# EAGLE board rl_energy_board (EAGLE 9.6.2)
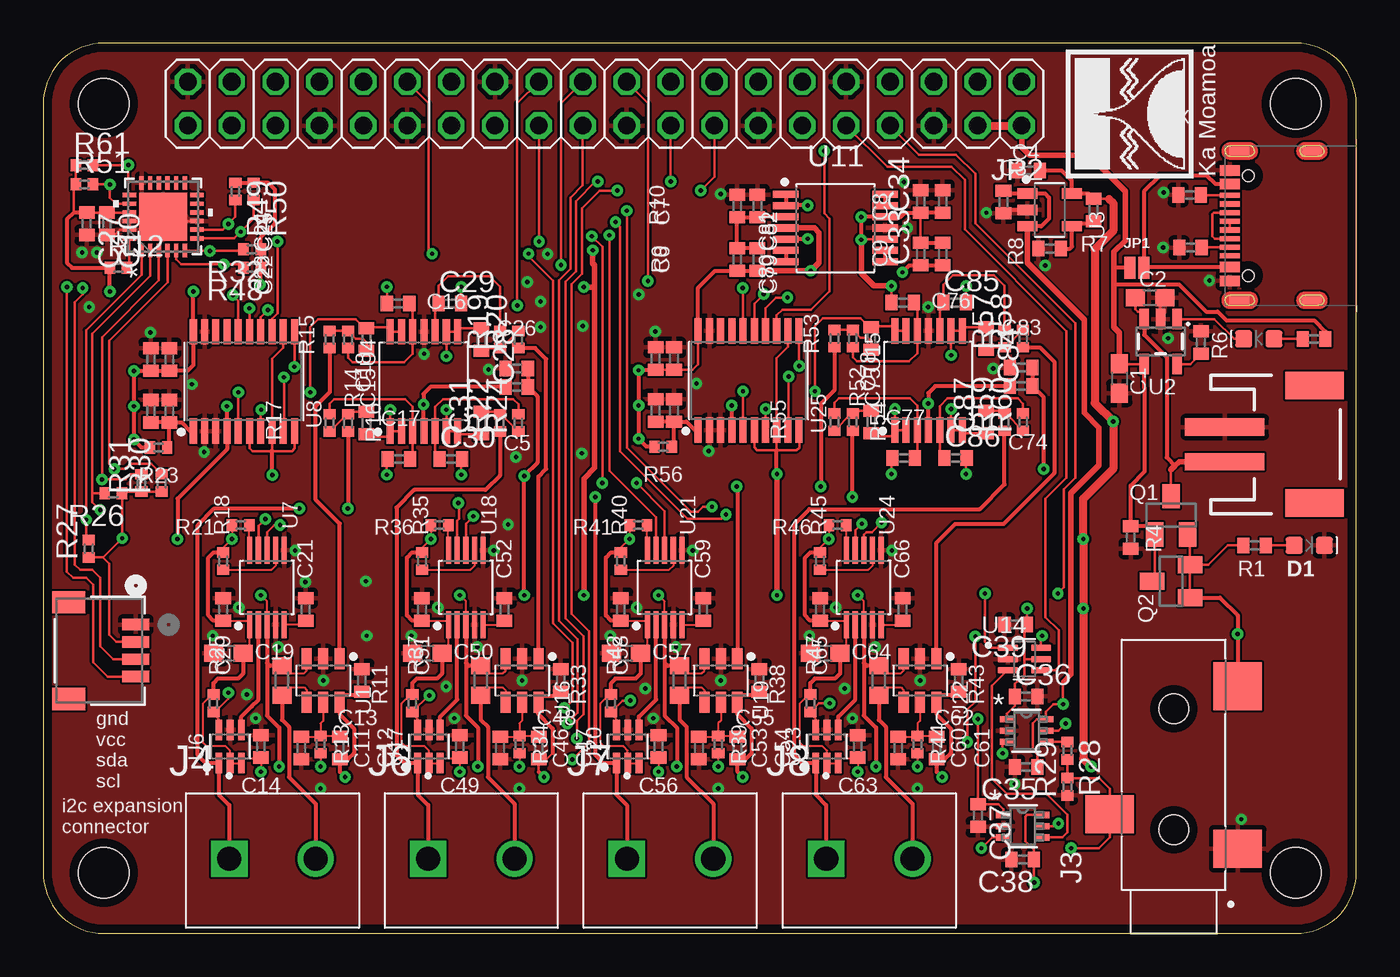
[diagram p4: board, top side]
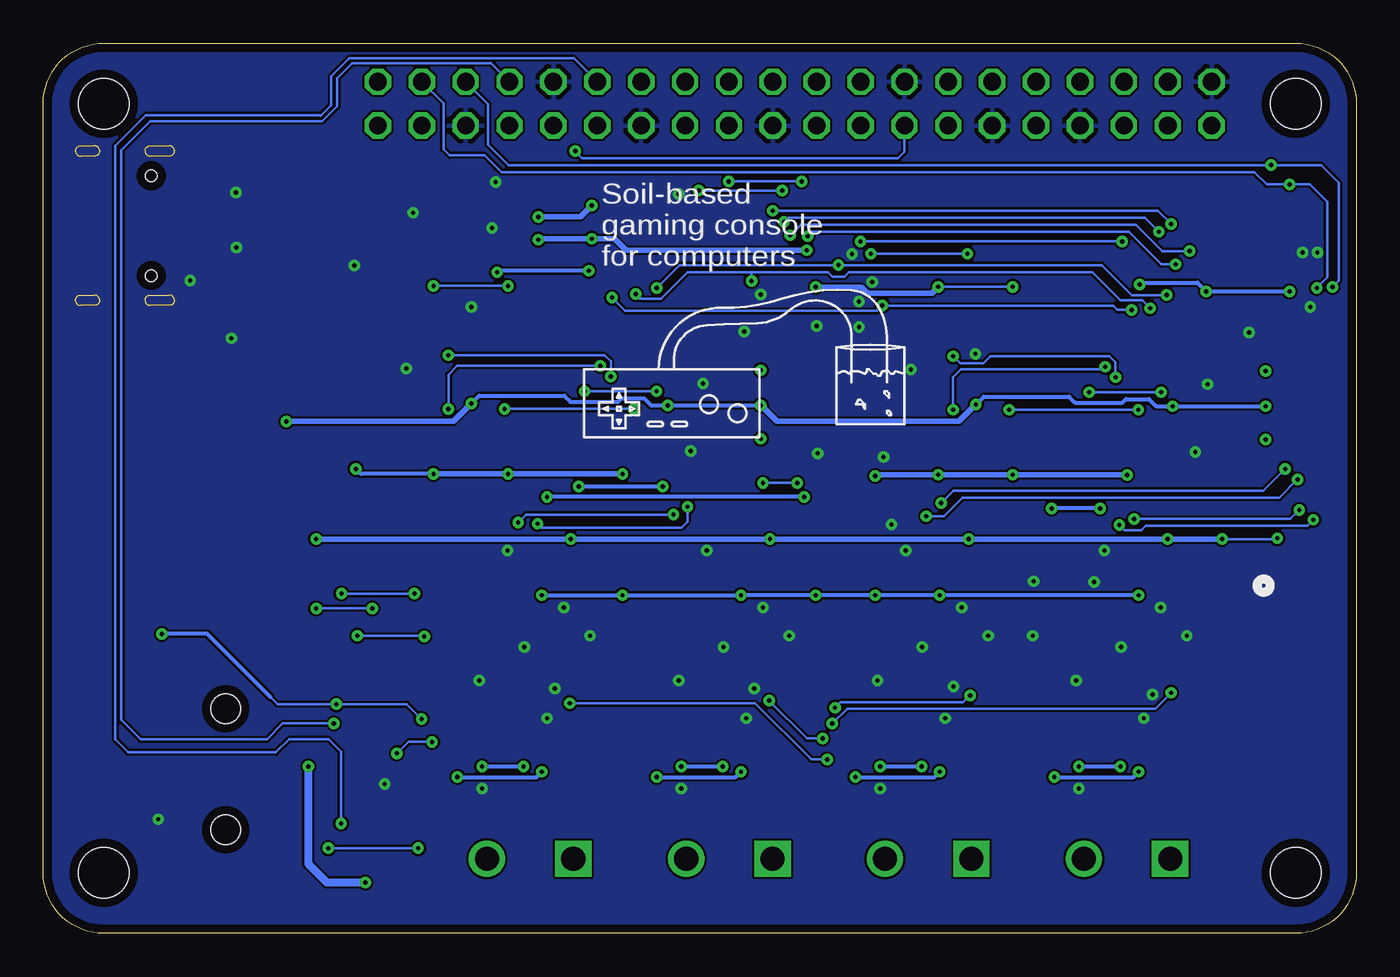
[diagram p5: board, bottom side, seen from below]

Size 76 x 51.5 mm. Coordinates in mm from the lower left corner, seen from the top.
Outline: 0,3.5 arc90 3.5,0 72.5,0 arc90 76,3.5 76,48 arc90 72.5,51.5 3.5,51.5 arc90 0,48 0,3.5
Copper layers (1*16): Top 0.035mm / dielectric 1.5mm / Bottom 0.035mm
Design rules "default *": minimum track width 5mil, minimum drill 0.25mm, track to track 5mil, track to pad 5mil, pad to pad 5mil, via to via 5mil, smd to smd 5mil, copper to edge 20mil, drill to drill 6mil, minimum pad ring 10mil, minimum via ring 8mil, stop-mask expansion 4mil, vias tented up to drill 20mil, thermal gap 10mil
Holes 2.9 mm at 3.5,48 3.5,3.5 72.5,48 72.5,3.5

## Footprints (pad centres in the part's own frame; a part is rotated, then mirrored left to right if it is on the bottom)
C0603 = smd 1.1 x 1: 1 -0.85,0; 2 0.85,0
C0402 = smd 0.7 x 0.9: 1 -0.65,0; 2 0.65,0
LED-0603 = smd 1 x 1: A -0.877,0; C 0.877,0
JST-2-SMD = smd 1 x 4.6: 1 -1,-3.7; 2 1,-3.7 | smd 1.6 x 3.4: NC1 -3.4,1.5; NC2 3.4,1.5
USB4105 = smd 0.6 x 1.15: A1B12 -3.2,4.755; A4B9 -2.4,4.755; B1A12 3.2,4.755; B4A9 2.4,4.755; SHELL_GND@0 -4.3,4.2; SHELL_GND@1 4.3,4.2; SHELL_GND@2 -4.3,0; SHELL_GND@3 4.3,0 | smd 0.3 x 1.15: A5 -1.25,4.755; A6 -0.25,4.755; A7 0.25,4.755; A8 1.25,4.755; B5 1.75,4.755; B6 0.75,4.755; B7 -0.75,4.755; B8 -1.75,4.755 | hole 0.65: -2.89,3.68; 2.89,3.68
CUI_SJ-3523-SMT-TR = smd 2.2 x 2.8: 1 -1.1,-3.7; 3 0.9,3.7 | smd 2.8 x 2.8: 2 8.3,-3.7 | hole 1.7: 0,0; 7,0
CUI_TB003-500-P02BE = drill 1.4 square: 1 0,0 | drill 1.4: 2 5,0
CONN_SM04B-SRSS-TB_JST = smd 0.66 x 1.549: 1 1.5,-2.099; 2 0.5,-2.099; 3 -0.5,-2.099; 4 -1.5,-2.099 | smd 1.295 x 1.905: 5 -2.8,1.776; 6 2.8,1.776
SMT-JUMPER_2_NO_NO-SILK = smd 0.635 x 1.27: 1 -0.406,0; 2 0.406,0
2X20 = drill 1.016 octagon: 1 -24.13,-1.27; 2 -24.13,1.27; 3 -21.59,-1.27; 4 -21.59,1.27; 5 -19.05,-1.27; 6 -19.05,1.27; 7 -16.51,-1.27; 8 -16.51,1.27; 9 -13.97,-1.27; 10 -13.97,1.27; 11 -11.43,-1.27; 12 -11.43,1.27; 13 -8.89,-1.27; 14 -8.89,1.27; 15 -6.35,-1.27; 16 -6.35,1.27; 17 -3.81,-1.27; 18 -3.81,1.27; 19 -1.27,-1.27; 20 -1.27,1.27; 21 1.27,-1.27; 22 1.27,1.27; 23 3.81,-1.27; 24 3.81,1.27; 25 6.35,-1.27; 26 6.35,1.27; 27 8.89,-1.27; 28 8.89,1.27; 29 11.43,-1.27; 30 11.43,1.27; 31 13.97,-1.27; 32 13.97,1.27; 33 16.51,-1.27; 34 16.51,1.27; 35 19.05,-1.27; 36 19.05,1.27; 37 21.59,-1.27; 38 21.59,1.27; 39 24.13,-1.27; 40 24.13,1.27
SOT23 = smd 1 x 1.4: 1 -0.95,-1.1; 2 0.95,-1.1; 3 0,1.1
R0402 = smd 0.7 x 0.9: 1 -0.65,0; 2 0.65,0
R0603 = smd 1 x 1.1: 1 -0.85,0; 2 0.85,0
R0402' = smd 0.6 x 0.7: 1 -0.5,0; 2 0.5,0
SOT95P280X145-6N = smd 1.209 x 0.584: 1 -1.253,0.95; 2 -1.253,0; 3 -1.253,-0.95; 4 1.253,-0.95; 5 1.253,0; 6 1.253,0.95
SOT23-5 = smd 0.55 x 1.2: 1 -0.95,-1.3; 2 0,-1.3; 3 0.95,-1.3; 4 0.95,1.3; 5 -0.95,1.3
SOT95P285X130-5N = smd 1.146 x 0.597: 1 -1.287,0.95; 2 -1.287,0; 3 -1.287,-0.95; 4 1.287,-0.95; 5 1.287,0.95
SOP65P640X120-14N = smd 1.469 x 0.407: 1 -2.871,1.95; 2 -2.871,1.3; 3 -2.871,0.65; 4 -2.871,0; 5 -2.871,-0.65; 6 -2.871,-1.3; 7 -2.871,-1.95; 8 2.871,-1.95; 9 2.871,-1.3; 10 2.871,-0.65; 11 2.871,0; 12 2.871,0.65; 13 2.871,1.3; 14 2.871,1.95
QFN_GERQ1_TEX = smd 0.787 x 0.254: 1 -1.956,1.25; 2 -1.956,0.75; 3 -1.956,0.25; 4 -1.956,-0.25; 5 -1.956,-0.75; 6 -1.956,-1.25; 13 1.956,-1.25; 14 1.956,-0.75; 15 1.956,-0.25; 16 1.956,0.25; 17 1.956,0.75; 18 1.956,1.25 | smd 0.254 x 0.787: 7 -1.25,-1.956; 8 -0.75,-1.956; 9 -0.25,-1.956; 10 0.25,-1.956; 11 0.75,-1.956; 12 1.25,-1.956; 19 1.25,1.956; 20 0.75,1.956; 21 0.25,1.956; 22 -0.25,1.956; 23 -0.75,1.956; 24 -1.25,1.956 | smd 2.794 x 2.794: 25 0,0
SOT65P210X110-6N = smd 1.186 x 0.397: 1 -0.962,0.65; 2 -0.962,0; 3 -0.962,-0.65; 4 0.962,-0.65; 5 0.962,0; 6 0.962,0.65
SOP50P490X95-10N = smd 1.55 x 0.297: 1 -2.156,1; 2 -2.156,0.5; 3 -2.156,0; 4 -2.156,-0.5; 5 -2.156,-1; 6 2.156,-1; 7 2.156,-0.5; 8 2.156,0; 9 2.156,0.5; 10 2.156,1
SOP65P640X120-20N = smd 1.469 x 0.407: 1 -2.871,2.925; 2 -2.871,2.275; 3 -2.871,1.625; 4 -2.871,0.975; 5 -2.871,0.325; 6 -2.871,-0.325; 7 -2.871,-0.975; 8 -2.871,-1.625; 9 -2.871,-2.275; 10 -2.871,-2.925; 11 2.871,-2.925; 12 2.871,-2.275; 13 2.871,-1.625; 14 2.871,-0.975; 15 2.871,-0.325; 16 2.871,0.325; 17 2.871,0.975; 18 2.871,1.625; 19 2.871,2.275; 20 2.871,2.925
SOT_101QDCKRQ1_TEX = smd 0.851 x 0.356: 1 -1.124,0.65; 2 -1.124,0; 3 -1.124,-0.65; 4 1.124,-0.65; 5 1.124,0; 6 1.124,0.65
SOT65P210X110-6N' = smd 1.19 x 0.4: 1 -0.96,0.65; 2 -0.96,0; 3 -0.96,-0.65; 4 0.96,-0.65; 5 0.96,0; 6 0.96,0.65

## Placement (x,y rotation side)
C1  4.7u  [C0603]  62.28,32.11 270 top
C2  4.7u  [C0603]  64.06,36.78 0 top
C3  1u  [C0402]  55.58,42.32 270 top
C4  1u  [C0402]  57.03,44.14 180 top
C5  1u  [C0402]  27.4,31.61 0 top
C6  1u  [C0402]  41.34,38.98 90 top
C7  1u  [C0402]  41.34,42.08 90 top
C8  1u  [C0402]  52.05,42.35 90 top
C9  1u  [C0402]  52.05,39.3 90 top
C10  .1u  [C0402]  3.69,41.05 270 top
C11  1u  [C0402]  14.94,10.72 270 top
C12  1u  [C0402]  17.17,10.72 90 top
C13  1u  [C0402]  18.44,14.63 90 top
C14  1u  [C0402]  12.6,10.82 90 top
C15  .1u  [C0402]  18.71,34.36 270 top
C16  10n  [C0402]  20.54,36.44 180 top
C17  10n  [C0402]  20.59,27.45 180 top
C18  .1u  [C0402]  18.71,29.53 90 top
C19  4.7u  [C0603]  10.72,16.21 180 top
C20  .1u  [C0402]  10.42,18.75 90 top
C21  1u  [C0402]  15.19,18.75 90 top
C22  .1u  [C0402]  7.3,30.21 90 top
C23  1u  [C0402]  6.23,30.21 90 top
C24  .1u  [C0402]  6.23,33.2 90 top
C25  1u  [C0402]  7.3,33.2 90 top
C26  1u  [C0402]  27.4,32.68 180 top
C27  1u  [C0402]  2.53,41.05 270 top
C28  .1u  [C0402]  25.37,34.36 270 top
C29  10n  [C0402]  23.54,36.44 0 top
C30  10n  [C0402]  23.59,27.45 0 top
C31  .1u  [C0402]  25.37,29.53 90 top
C33  1u  [C0402]  50.78,39.3 90 top
C34  1u  [C0402]  50.78,42.35 90 top
C35  100n  [C0402]  56.88,9.63 180 top
C36  100n  [C0402]  56.88,13.7 0 top
C37  100n  [C0402]  54.1,6.81 270 top
C38  100n  [C0402]  56.69,4.27 180 top
C39  100n  [C0402]  56.29,17.87 180 top
C46  1u  [C0402]  26.45,10.72 270 top
C47  1u  [C0402]  28.68,10.72 90 top
C48  1u  [C0402]  29.95,14.63 90 top
C49  1u  [C0402]  24.11,10.82 90 top
C50  4.7u  [C0603]  22.23,16.21 180 top
C51  .1u  [C0402]  21.92,18.75 90 top
C52  1u  [C0402]  26.7,18.75 90 top
C53  1u  [C0402]  37.95,10.72 270 top
C54  1u  [C0402]  40.19,10.72 90 top
C55  1u  [C0402]  41.46,14.63 90 top
C56  1u  [C0402]  35.61,10.82 90 top
C57  4.7u  [C0603]  33.73,16.21 180 top
C58  .1u  [C0402]  33.43,18.75 90 top
C59  1u  [C0402]  38.2,18.75 90 top
C60  1u  [C0402]  49.48,10.72 270 top
C61  1u  [C0402]  51.72,10.72 90 top
C62  1u  [C0402]  52.99,14.63 90 top
C63  1u  [C0402]  47.14,10.82 90 top
C64  4.7u  [C0603]  45.27,16.21 180 top
C65  .1u  [C0402]  44.96,18.75 90 top
C66  1u  [C0402]  49.74,18.75 90 top
C74  1u  [C0402]  56.61,31.66 0 top
C75  .1u  [C0402]  47.92,34.41 270 top
C76  10n  [C0402]  49.75,36.49 180 top
C77  10n  [C0402]  49.8,27.5 180 top
C78  .1u  [C0402]  47.92,29.58 90 top
C79  .1u  [C0402]  36.51,30.26 90 top
C80  1u  [C0402]  35.44,30.26 90 top
C81  .1u  [C0402]  35.44,33.26 90 top
C82  1u  [C0402]  36.51,33.26 90 top
C83  1u  [C0402]  56.61,32.73 180 top
C84  .1u  [C0402]  54.58,34.41 270 top
C85  10n  [C0402]  52.75,36.49 0 top
C86  10n  [C0402]  52.8,27.5 0 top
C87  .1u  [C0402]  54.58,29.58 90 top
D1  [LED-0603]  73.28,22.45 0 top
D2  [LED-0603]  70.36,34.39 180 top
J1  [JST-2-SMD]  72.08,28.29 270 top
J2  USB4105  [USB4105]  73.43,40.94 90 top
J3  SJ-3523-SMT-TR  [CUI_SJ-3523-SMT-TR]  65.43,5.99 90 top
J4  TB003-500-P02BE  [CUI_TB003-500-P02BE]  10.77,4.32 0 top
J6  TB003-500-P02BE  [CUI_TB003-500-P02BE]  22.28,4.32 0 top
J7  TB003-500-P02BE  [CUI_TB003-500-P02BE]  33.78,4.32 0 top
J8  TB003-500-P02BE  [CUI_TB003-500-P02BE]  45.32,4.32 0 top
J9  SM04B-SRSS-TB  [CONN_SM04B-SRSS-TB_JST]  3.25,16.36 90 top
JP1  JUMPER-SMT_2_NO_NO-SILK  [SMT-JUMPER_2_NO_NO-SILK]  63.3,38.51 0 top
JP2  PINHD-2X20  [2X20]  32.5,48 180 top
Q1  BSS84  [SOT23]  65.28,24.18 0 top
Q2  BSS84  [SOT23]  65.28,20.37 90 top
R1  2.2k  [R0402]  70.1,22.45 180 top
R2  5.1k  [R0402]  66.4,39.67 0 top
R3  5.1k  [R0402]  66.34,42.72 0 top
R4  5.1k  [R0402]  62.94,22.91 90 top
R5  2.2k  [R0402]  73.56,34.39 0 top
R6  2.2k  [R0402]  67.01,34.19 270 top
R7  dnp  [R0402]  60.79,41.85 270 top
R8  dnp  [R0402]  58.25,39.61 180 top
R9  5.1k  [R0402]  40.17,38.98 90 top
R10  5.1k  [R0402]  40.17,42.08 90 top
R11  100  [R0603]  13.82,14.63 90 top
R12  5.1k  [R0402']  4.35,38.51 0 top
R13  100  [R0402']  16.06,10.92 90 top
R14  200k  [R0402']  17.65,34.36 270 top
R15  6.8k  [R0402']  16.58,34.36 90 top
R16  6.8k  [R0402']  17.65,29.53 90 top
R17  200k  [R0402']  16.58,29.53 90 top
R18  5.1k  [R0402']  10.42,21.54 270 top
R19  200k  [R0402']  26.43,34.36 90 top
R20  6.8k  [R0402']  27.5,34.36 90 top
R21  5.1k  [R0402']  11.43,23.62 0 top
R22  6.8k  [R0402']  26.43,29.53 90 top
R23  10  [R0402']  6.67,28.11 0 top
R24  200k  [R0402']  27.5,29.53 90 top
R25  5.1k  [R0402']  9.86,13.31 270 top
R26  5.1k  [R0402']  4.06,25.45 180 top
R27  5.1k  [R0402']  2.64,22.25 90 top
R28  2.2k  [R0402']  59.28,10.57 270 top
R29  200k  [R0402']  59.28,8.48 90 top
R30  5.1k  [R0402']  6.86,26.06 90 top
R31  5.1k  [R0402']  5.69,26.06 90 top
R32  5.1k  [R0402']  12.09,39.57 180 top
R33  100  [R0603]  25.33,14.63 90 top
R34  100  [R0402']  27.56,10.92 90 top
R35  5.1k  [R0402']  21.92,21.54 270 top
R36  5.1k  [R0402']  22.94,23.62 0 top
R37  5.1k  [R0402']  21.37,13.31 270 top
R38  100  [R0603]  36.83,14.63 90 top
R39  100  [R0402']  39.07,10.92 90 top
R40  5.1k  [R0402']  33.43,21.54 270 top
R41  5.1k  [R0402']  34.44,23.62 0 top
R42  5.1k  [R0402']  32.87,13.31 270 top
R43  100  [R0603]  48.36,14.63 90 top
R44  100  [R0402']  50.6,10.92 90 top
R45  5.1k  [R0402']  44.96,21.54 270 top
R46  5.1k  [R0402']  45.98,23.62 0 top
R47  5.1k  [R0402']  44.4,13.31 270 top
R48  5.1k  [R0402']  12.09,38.51 180 top
R49  5.1k  [R0402']  11.13,42.93 270 top
R50  5.1k  [R0402']  12.19,42.93 270 top
R51  5.1k  [R0402']  2.39,43.33 0 top
R52  200k  [R0402']  46.86,34.41 270 top
R53  6.8k  [R0402']  45.79,34.41 90 top
R54  6.8k  [R0402']  46.86,29.58 90 top
R55  200k  [R0402']  45.79,29.58 90 top
R56  10  [R0402']  35.88,28.16 0 top
R57  200k  [R0402']  55.64,34.41 90 top
R58  6.8k  [R0402']  56.71,34.41 90 top
R59  6.8k  [R0402']  55.64,29.58 90 top
R60  200k  [R0402']  56.71,29.58 90 top
R61  5.1k  [R0402']  2.39,44.45 0 top
U1  INA181  [SOT95P280X145-6N]  16.21,14.63 270 top
U2  MCP73831  [SOT23-5]  64.67,34.24 180 top
U3  AP7366  [SOT95P285X130-5N]  58.25,41.85 0 top
U4  MCP6074  [SOP65P640X120-14N]  22.03,31.93 90 top
U5  TCA9548ARGERQ1  [QFN_GERQ1_TEX]  6.95,41.46 90 top
U6  TMUX1247  [SOT65P210X110-6N]  10.82,10.81 90 top
U7  AD5272BRMZ-XXX  [SOP50P490X95-10N]  12.96,20.02 90 top
U8  MCP3564  [SOP65P640X120-20N]  11.62,31.93 90 top
U11  MCP6074  [SOP65P640X120-14N]  45.85,40.81 0 top
U12  TXU0101QDCKRQ1  [SOT_101QDCKRQ1_TEX]  56.91,11.73 0 top
U13  TXU0101QDCKRQ1  [SOT_101QDCKRQ1_TEX]  56.69,6.2 0 top
U14  SN74LVC2G14DCKR  [SOT65P210X110-6N']  56.79,15.87 0 top
U15  MCP6074  [SOP65P640X120-14N]  51.24,31.99 90 top
U16  INA181  [SOT95P280X145-6N]  27.72,14.63 270 top
U17  TMUX1247  [SOT65P210X110-6N]  22.33,10.81 90 top
U18  AD5272BRMZ-XXX  [SOP50P490X95-10N]  24.46,20.02 90 top
U19  INA181  [SOT95P280X145-6N]  39.22,14.63 270 top
U20  TMUX1247  [SOT65P210X110-6N]  33.83,10.81 90 top
U21  AD5272BRMZ-XXX  [SOP50P490X95-10N]  35.97,20.02 90 top
U22  INA181  [SOT95P280X145-6N]  50.75,14.63 270 top
U23  TMUX1247  [SOT65P210X110-6N]  45.36,10.81 90 top
U24  AD5272BRMZ-XXX  [SOP50P490X95-10N]  47.5,20.02 90 top
U25  MCP3564  [SOP65P640X120-20N]  40.83,31.99 90 top

## Tracks (layer width: path | path; a pad name or v marks a point on that pad's centre or on a via)
5V
  Top 0.152: Q2.3 64.33,20.52 Q1.1 63.88,23.53 | U2.4 62.3,32.94 C1.1
  Top 0.229: U2.4 63.72,31.58 63.75,31.55 63.75,26.72 62.94,25.91 R4.2 63.85,23.56 63.88,23.53 | JP1.1 62.03,38.51 61.98,38.56 | R5.2 74.21,34.81 73.56,35.46 68.48,35.46 67.97,35.97 67.31,35.97 65.73,37.54 61.98,37.54
  Top 0.305: C1.1 62.28,34.75 61.98,35.05 61.98,37.54 61.98,38.56 61.98,39.42 62.64,40.08 62.64,42.93 60.55,45.01 57.1,45.01 56.63,45.48 JP2.2
  Top 0.457: JP1.1 | JP2.4 JP2.2
!RPI_RX!_TEROS_TX
  Top 0.152: U13.4 58.99,5.55 59.28,5.84 59.28,6.86 58.06,8.08 55.78,8.08 54.91,8.94 54.91,14.33 55.81,15.22 U14.3
!RPI_TX!_TEROS_RX  (via drill 0.25)
  Top 0.152: U14.6 57.76,17.17 v57.81,17.22 | v53.95,17.17 53.95,13.41 53.49,12.95 v53.49,11.07 | v55.52,10.41 55.52,11.07 55.47,11.12 55.74,11.12 U12.3
  Bottom 0.152: v57.81,17.22 54,17.22 v53.95,17.17 | v53.49,11.07 54.86,11.07 v55.52,10.41
ADC0_!CS!  (via drill 0.25)
  Top 0.152: JP2.24 28.69,40.04 v28.7,40.03 | v13.56,40.03 13.56,35.87 13.24,35.55 U8.13
  Bottom 0.152: v28.7,40.03 v13.56,40.03
ADC1_!CS!  (via drill 0.25)
  Top 0.152: v45.21,45.26 45.21,41.66 45.52,41.35 45.52,37.13 44.45,36.07 42.77,36.07 42.45,35.75 U25.13
  Bottom 0.152: JP2.26 26.15,45.22 26.52,44.86 44.81,44.86 v45.21,45.26
ADC_CIPO  (via drill 0.25)
  Top 0.152: JP2.21 29.97,48.01 v29.97,38.66 | U8.16 11.29,36.61 v10.97,36.93 | U25.16 40.51,37.32 v40.49,37.34
  Bottom 0.152: v10.97,36.93 13.01,36.93 14.73,38.66 v29.97,38.66 39.17,38.66 v40.49,37.34
ADC_COPI  (via drill 0.25)
  Top 0.152: U8.15 v11.95,36.16 v11.94,36.17 | U25.15 41.16,36.43 v41.71,36.98 | JP2.19 35,48.04 v35,37.74
  Bottom 0.152: v11.94,36.17 12.39,36.63 13.66,36.63 15.29,38.25 29.36,38.25 29.62,38 30.33,38 30.58,38.25 35,38.25 | 35,38.25 38.71,38.25 40.23,36.73 41.45,36.73 v41.71,36.98 | v35,37.74 35,38.25
ADC_SCK  (via drill 0.25)
  Top 0.152: JP2.23 27.43,48.01 v27.43,36.32 | U25.14 41.8,36.17 42.42,36.78 v43.08,36.78 | U8.14 12.6,35.66 v13.01,36.07
  Bottom 0.152: v13.01,36.07 13.82,36.07 14.07,36.32 v27.43,36.32 27.74,36.02 42.32,36.02 v43.08,36.78
GND  (via drill 0.25)
  Top 0.152: U5.9 7.2,41.21 U5.25 6.7,41.21 U5.22 U5.23 4.44,40.71 4.13,40.41 C10.2 | C2.2 64.67,36.54 U2.2
  Top 0.229: C3.2 55.76,41.85 U3.2
  other vias: 13.62,16.56 11.79,13.82 9.81,17.22 11.33,18.85 14.58,22.15 16.06,8.38 12.3,12.45 16.21,14.63 9.32,27.85 39.22,42.77 50.02,40.81 49.82,43.47 6.22,34.76 8.6,31.77 25.77,32.63 22.05,33.53 25.12,16.56 23.32,14.27 21.31,17.22 22.84,18.85 26.09,22.15 27.56,8.38 23.8,12.45 27.72,14.63 36.63,16.56 34.85,14.17 32.82,17.22 34.34,18.85 37.59,22.15 39.07,8.38 35.31,12.45 39.22,14.63 48.16,16.56 46.38,14.17 44.35,17.22 45.87,18.85 49.13,22.15 50.6,8.38 46.84,12.45 50.75,14.63 38.53,27.91 35.43,34.81 37.81,31.82 54.98,32.68 51.23,36.24 54.59,41.69 69.34,6.6 56.24,8.64 64.85,42.86 64.82,39.67 2.25,39.39 3.12,39.39 15.17,20.32 18.67,20.37 18.72,17.22 2.66,36.24 58,38.64 65.11,34.43 67.5,37.78 29.19,39.3 34.48,36.97 28.79,36.56 28.02,37.68 31.22,35.14 28.79,35.09 26.91,23.66 31.17,27.77 27.36,27.57
  pour Top (rank 3): -1,53 78,53 78,-1 -1,-1
  pour Bottom (rank 2): -1,53 78,53 78,-1 -1,-1
ISENSE_0
  Top 0.229: U1.1 17.16,23.71 15.75,25.12 15.75,30.48 16.58,31.31 R15.1
ISENSE_1
  Top 0.229: R20.1 28.48,33.86 29.11,33.22 29.11,26.87 28.67,26.43 U16.1
ISENSE_2  (via drill 0.25)
  Top 0.229: R53.1 45.79,31.41 45.01,30.63 v45.01,25.86 | v40.13,25.86 40.17,25.82 U19.1
  Bottom 0.229: v45.01,25.86 v40.13,25.86
ISENSE_3
  Top 0.229: U22.1 51.7,22.61 52.77,23.67 55.58,23.67 58.52,26.62 58.52,33.07 57.69,33.91 R58.1
ISENSE_LPF_0  (via drill 0.25)
  Top 0.152: U4.13 U4.14 20.03,34.85 20.03,35.07 18.77,35.07 C15.1 18.61,35.01 18.09,35.52 15.92,35.52 15.46,35.07 v15.46,31.31 | U8.5 v11.29,31.31 v11.3,31.31
  Bottom 0.152: v11.3,31.31 v15.46,31.31
ISENSE_LPF_1  (via drill 0.25)
  Top 0.152: C28.1 24.01,35.01 23.95,35.07 23.95,34.84 U4.8 U4.9 v23.33,33.39 v23.34,33.39 | v13.94,32.17 13.94,29.11 U8.9
  Bottom 0.152: v13.94,32.17 13.94,33.04 14.29,33.39 21.17,33.39 21.59,32.97 22.91,32.97 v23.34,33.39
ISENSE_LPF_2  (via drill 0.25)
  Top 0.152: U15.13 U15.14 49.24,34.91 49.24,35.12 47.98,35.12 C75.1 47.82,35.06 47.3,35.58 45.13,35.58 44.67,35.12 v44.67,31.36 | U25.5 v40.51,31.36
  Bottom 0.152: v40.51,31.36 v44.67,31.36
ISENSE_LPF_3  (via drill 0.25)
  Top 0.152: C84.1 53.22,35.06 53.16,35.12 53.16,34.9 U15.8 U15.9 v52.54,33.45 v52.55,33.44 | v43.15,32.22 43.15,29.16 U25.9
  Bottom 0.152: v43.15,32.22 43.15,33.09 43.5,33.44 v52.55,33.44
ISENSE_V+_0
  Top 0.152: C16.1 21.38,36.25 U4.12 21.38,33.52 20.9,33.04 17.9,33.04 17.65,33.29 R14.2
ISENSE_V+_1
  Top 0.152: U4.10 22.68,36.23 C29.1 22.89,37.47 23.44,38.01 25.82,38.01 26.43,37.41 R19.2
ISENSE_V+_2
  Top 0.152: C76.1 50.59,36.3 U15.12 50.59,33.57 50.11,33.09 47.11,33.09 46.86,33.34 R52.2
ISENSE_V+_3
  Top 0.152: U15.10 51.89,36.28 C85.1 52.1,37.52 52.65,38.06 55.03,38.06 55.65,37.46 R57.2
MFC+_0  (via drill 0.25)
  Top 0.229: J4.1 10.77,7.42 10.17,8.02 U6.1 9.4,9.85 8.94,10.31 8.94,23.62 9.91,24.59 v14.83,24.59 | v17.63,24.59 17.65,24.61 R16.1
  Bottom 0.229: v14.83,24.59 v17.63,24.59
MFC+_1
  Top 0.229: J6.1 22.28,7.42 21.68,8.02 U17.1 20.91,9.85 20.45,10.31 20.45,24.64 21.47,25.65 25.6,25.65 26.43,26.49 R22.1
MFC+_2  (via drill 0.25)
  Top 0.229: J7.1 33.78,7.42 33.18,8.02 U20.1 32.42,9.85 31.96,10.31 v31.96,25.25 v31.95,25.25 | v46.84,25.25 46.84,29.06 R54.1
  Bottom 0.229: v31.95,25.25 v46.84,25.25
MFC+_3
  Top 0.229: J8.1 45.32,7.42 44.71,8.02 U23.1 43.95,9.85 43.49,10.31 43.49,23.68 44.35,24.54 54.2,24.54 55.65,25.98 R59.1
MFC-
  Top 0.127: R11.1 14.26,14.22 15.09,14.22 15.26,14.06 U1.4
  Top 0.229: J4.2 15.77,7.5 14.23,9.04 14.23,11.94 13.82,12.34 R11.1
MFC-_1
  Top 0.127: R33.1 25.77,14.22 26.6,14.22 26.77,14.06 U16.4
  Top 0.229: J6.2 27.28,7.5 25.73,9.04 25.73,11.94 25.33,12.34 R33.1
MFC-_2
  Top 0.127: R38.1 37.28,14.22 38.1,14.22 38.27,14.06 U19.4
  Top 0.229: J7.2 38.78,7.5 37.24,9.04 37.24,11.94 36.83,12.34 R38.1
MFC-_3
  Top 0.127: R43.1 48.81,14.22 49.63,14.22 49.8,14.06 U22.4
  Top 0.229: J8.2 50.32,7.5 48.77,9.04 48.77,11.94 48.36,12.34 R43.1
N$1
  Top 0.152: R1.1 D1.A
N$2
  Top 0.152: U2.1 67.79,35.54 68.94,34.39 D2.C
N$3
  Top 0.152: R6.2 66.41,32.94 U2.5
N$4
  Top 0.152: J2.B6 67.75,41.7 67.67,41.6 67.67,40.34 67.81,40.2 J2.B7
N$5
  Top 0.152: J2.A6 J2.A7
N$6
  Top 0.152: J2.A5 67.07,39.7 R2.2
N$7
  Top 0.152: J2.B5 67.02,42.7 R3.2
N$8
  Top 0.152: D2.A R5.1
N$9
  Top 0.152: U5.24 4.99,38.65 R12.2
N$10
  Top 0.229: R7.2 60.63,41.05 59.68,41.05 U3.4 59.54,39.73 59.43,39.61 R8.1
N$11
  Top 0.152: C28.2 25.52,33.86 R19.1 26.5,33.86 R20.2
N$12
  Top 0.127: C11.1 16.11,11.37 | C12.2 17.12,11.42 R13.2 16.05,12.14 16.21,12.29 U1.5
  Top 0.152: C11.1 | 16.11,11.37 R13.2
N$13
  Top 0.229: U6.4 11.47,12.53 12.07,13.13 12.46,13.52 U7.2
N$14
  Top 0.229: C22.1 C23.1 | R23.2 7.3,28.24 C22.1 | C22.1 8.02,29.56 8.51,29.06 U8.1
N$17
  Top 0.152: R15.2 R14.1 18.1,34.41 18.51,34.41 18.71,34.2 C15.2
N$18
  Top 0.152: C18.2 17.8,30.18 R16.2 17.58,30.03 R17.1
N$19
  Top 0.229: U11.6 U11.7
N$20
  Top 0.229: U11.9 U11.8
N$21
  Top 0.152: C31.2 26.29,30.18 R22.2 26.5,30.03 R24.1
N$22
  Top 0.229: U11.14 U11.13
N$23
  Top 0.152: U12.4 R28.1
N$26
  Top 0.127: C46.1 27.62,11.37 | C47.2 28.63,11.42 R34.2 27.56,12.14 27.72,12.29 U16.5
  Top 0.152: C46.1 | 27.62,11.37 R34.2
N$27
  Top 0.229: U17.4 22.98,12.53 23.96,13.52 U18.2
N$28
  Top 0.127: C53.1 39.12,11.37 | C54.2 40.13,11.42 R39.2 39.07,12.14 39.22,12.29 U19.5
  Top 0.152: C53.1 | 39.12,11.37 R39.2
N$29
  Top 0.229: U20.4 34.48,12.53 35.47,13.52 U21.2
N$30
  Top 0.127: C60.1 50.65,11.37 | C61.2 51.66,11.42 R44.2 50.6,12.14 50.75,12.29 U22.5
  Top 0.152: C60.1 | 50.65,11.37 R44.2
N$31
  Top 0.229: U23.4 46.01,12.53 47,13.52 U24.2
N$35
  Top 0.152: C78.2 47.01,30.23 R54.2 46.79,30.08 R55.1
N$36
  Top 0.152: R53.2 R52.1 47.31,34.46 47.72,34.46 47.92,34.26 C75.2
N$37
  Top 0.229: C79.1 C80.1 | R56.2 36.51,28.29 C79.1 | C79.1 37.23,29.61 37.72,29.11 U25.1
N$38
  Top 0.152: C84.2 54.73,33.91 R57.1 55.71,33.91 R58.2
N$39
  Top 0.152: C87.2 55.49,30.23 R59.2 55.71,30.08 R60.1
PI_I2C1_SCL  (via drill 0.25)
  Top 0.152: U5.19 4.93,42.77 v4.93,44.45 R61.2 | J9.4 3.73,14.86 2.9,15.7 2.9,20.17 2.49,20.57 1.73,20.57 1.37,20.93 v1.37,37.39
  Bottom 0.152: JP2.5 50.24,47.96 50.24,45.62 49.07,44.45 v4.93,44.45 2.03,44.45 1.02,43.43 1.02,37.74 v1.37,37.39
PI_I2C1_SDA  (via drill 0.25)
  Top 0.152: U5.20 4.28,42.21 4.23,42.26 4.17,42.26 3.86,42.57 3.86,43.28 | 3.86,43.28 v3.86,43.33 | R51.2 3.81,43.33 3.86,43.28 | J9.3 4.06,15.86 3.3,16.61 3.3,20.57 2.85,21.03 2.13,21.03 1.83,21.34 1.83,36.52 2.29,36.98 v2.29,37.34
  Bottom 0.152: JP2.3 52.83,48.01 52.83,45.36 52.48,45.01 50.44,45.01 49.48,44.04 5.89,44.04 5.18,43.33 v3.86,43.33 2.69,43.33 1.68,42.32 1.68,37.95 v2.29,37.34
POT_!RESET_0
  Top 0.127: R18.2 13.22,21.04 13.46,21.28 U7.7
  Top 0.152: 13.41,22.13 U7.7
POT_!RESET_1
  Top 0.127: R35.2 24.73,21.04 24.96,21.28 U18.7
  Top 0.152: 24.92,22.13 U18.7
POT_!RESET_2
  Top 0.127: R40.2 36.23,21.04 36.47,21.28 U21.7
  Top 0.152: 36.43,22.13 U21.7
POT_!RESET_3
  Top 0.127: R45.2 47.76,21.04 48,21.28 U24.7
  Top 0.152: 47.96,22.13 U24.7
POT_ADDR_0
  Top 0.127: U7.10 11.93,22.2 R21.2
POT_ADDR_1
  Top 0.127: U18.10 23.44,22.2 R36.2
POT_ADDR_2
  Top 0.127: U21.10 34.95,22.2 R41.2
POT_ADDR_3
  Top 0.127: U24.10 46.48,22.2 R46.2
POT_EXT_CAP_0
  Top 0.127: C21.1 14.96,17.86 U7.5
  Top 0.152: U7.5
POT_EXT_CAP_1
  Top 0.127: U18.5 26.46,17.86 C52.1
  Top 0.152: U18.5 25.47,17.85
POT_EXT_CAP_2
  Top 0.127: U21.5 37.97,17.86 C59.1
  Top 0.152: U21.5
POT_EXT_CAP_3
  Top 0.127: U24.5 49.5,17.86 C66.1
  Top 0.152: U24.5
POT_SCL_0  (via drill 0.25)
  Top 0.152: U5.2 6.2,38.05 2.85,34.7 2.85,25.45 | v3.3,24.49 2.85,24.94 2.85,25.45 | U7.9 12.46,23.58 v12.85,23.98 | R26.2 2.85,25.45
  Bottom 0.152: v12.85,23.98 3.81,23.98 v3.3,24.49
POT_SCL_1  (via drill 0.25)
  Top 0.152: U5.4 7.2,37.67 3.81,34.29 3.81,27.18 v4.12,26.87 4.72,26.87 5.03,27.18 6.24,27.18 R30.2 | U18.9 23.96,23.86 24.08,23.98 24.08,24.84 v24.03,24.89
  Bottom 0.152: v4.12,26.87 5.38,25.6 23.32,25.6 v24.03,24.89
POT_SCL_2  (via drill 0.25)
  Top 0.152: U21.9 35.47,24.07 32.77,26.77 v32.77,40.39 | U5.6 9.62,39.51 | 9.62,39.51 v9.65,39.47 | R32.2 11.52,39.51 9.62,39.51
  Bottom 0.152: v9.65,39.47 11.23,39.47 12.75,41 32.16,41 v32.77,40.39
POT_SCL_3  (via drill 0.25)
  Top 0.152: v38.71,24.68 38.2,24.68 37.91,24.38 37.49,24.38 33.78,28.09 v33.78,41.81 | U24.9 47,23.32 v47.38,23.7 | U5.8 10.38,40.71 v10.72,41.05 11.12,41.45 R49.2
  Bottom 0.152: v38.71,24.68 38.71,23.82 39.06,23.47 47.15,23.47 v47.38,23.7 | v10.72,41.05 11.48,41.81 v33.78,41.81
POT_SDA_0  (via drill 0.25)
  Top 0.152: U5.1 5.7,38.1 2.49,34.9 v2.49,23.93 2.49,22.9 R27.2 2.7,22.76 | U7.8 12.96,23.22 13.36,23.62 v13.72,23.62
  Bottom 0.152: v2.49,23.93 2.85,23.57 12.19,23.57 12.45,23.32 13.41,23.32 v13.72,23.62
POT_SDA_1  (via drill 0.25)
  Top 0.152: U5.3 6.7,37.78 3.4,34.49 v3.4,26.26 4.78,26.26 5.07,26.56 R31.2 | U18.8 24.46,23.7 v24.89,24.13
  Bottom 0.152: v3.4,26.26 4.47,25.2 22.81,25.2 23.88,24.13 v24.89,24.13
POT_SDA_2  (via drill 0.25)
  Top 0.152: U5.5 7.7,38.99 7.98,38.71 v10.46,38.71 11.39,38.71 R48.2 | v34.34,26.06 35.97,24.43 U21.8 | v32.36,26.06 32.36,39.73 v31.75,40.34
  Bottom 0.152: v32.36,26.06 v34.34,26.06 | v10.46,38.71 11.28,38.71 13.16,40.59 31.5,40.59 v31.75,40.34
POT_SDA_3  (via drill 0.25)
  Top 0.152: v39.52,24.23 39.27,23.98 37.29,23.98 33.38,27.89 33.38,40.89 v33.12,41.15 | U24.8 47.5,23.07 47.65,23.22 47.95,23.22 v48.51,23.77 | U5.7 11.05,40.21 v11.43,40.59 12.19,41.35 R50.2
  Bottom 0.152: v39.52,24.23 48.06,24.23 v48.51,23.77 | v11.43,40.59 12.24,41.4 32.87,41.4 v33.12,41.15
RPI_RX_!TEROS_TX!
  Top 0.152: JP2.10 48.85,44.35 52.58,44.35 53.34,43.59 53.34,40.74 59.23,34.85 59.23,26.36 58.01,25.15 58.01,18.29 58.78,17.53 58.78,15.44 58.55,15.22 U14.4
RPI_TX_!TEROS_RX!  (via drill 0.25)
  Top 0.152: JP2.8 50.68,45.06 52.83,45.06 53.95,43.94 53.95,41.1 59.74,35.31 59.74,26.36 59.08,25.7 59.08,20.02 v58.73,19.66 | v54.51,19.66 54.51,16.87 54.86,16.51 U14.1
  Bottom 0.152: v58.73,19.66 v54.51,19.66
TEROS_DATA  (via drill 0.25)
  Top 0.152: R28.2 R29.2 61.12,8.98 61.73,8.37 J3.3 61.73,5.55 61.11,4.93 v59.49,4.93 | U13.3 54.92,5.55 v54.3,4.93
  Bottom 0.152: v54.3,4.93 v59.49,4.93
TEROS_RX_EN  (via drill 0.25)
  Top 0.152: U13.5 58.6,6.2 v58.75,6.35
  Bottom 0.152: JP2.11 45.28,50.62 58.29,50.62 59.33,49.58 59.33,47.9 59.92,47.32 | 59.92,47.32 59.94,47.3 | 59.92,47.32 70.08,47.32 71.83,45.57 71.83,11.23 71.07,10.46 62.53,10.46 61.77,11.23 59.49,11.23 58.75,10.49 v58.75,6.35
TEROS_TX_EN  (via drill 0.25)
  Top 0.152: U12.5 58.77,11.73 v59.18,12.14
  Bottom 0.152: JP2.7 50.08,50.34 58.12,50.34 58.98,49.48 58.98,47.87 59.85,46.99 69.8,46.99 71.48,45.31 71.48,12.34 70.36,11.23 63.04,11.23 62.13,12.14 v59.18,12.14
VBAT
  Top 0.152: C2.1 63.21,36.1 63.35,35.97 63.5,35.97 63.72,35.75 U2.3 | 65.28,26.82 Q1.3
  Top 0.229: U2.3 63.72,34.63 65.02,33.33 65.02,27.53 65.51,27.05
  Top 0.305: J1.2 65.75,27.29 65.51,27.05 65.28,26.82
VCC  (via drill 0.25)
  Top 0.127: 11.43,9.85 U6.2 10.82,10.57 10.57,10.82 9.45,10.82 9.25,11.02 9.25,13.31 9.86,13.92 | 11.43,9.85 U6.3 | 11.43,9.85 11.43,10.01 11.53,10.11 12.54,10.11 C14.1 v12.6,9.35 | C20.1 11.85,18.09 11.94,18.19 11.96,18.17 U7.1 11.96,16.59 C19.1 | R18.1 10.42,22.3 v10.92,22.81 10.93,22.82 R21.1 | 22.94,9.85 U17.2 22.33,10.57 22.08,10.82 20.96,10.82 20.76,11.02 20.76,13.31 21.26,13.81 R37.1 | 22.94,9.85 U17.3 | 22.94,9.85 22.94,10.01 23.04,10.11 24.05,10.11 C49.1 v24.11,9.35 | C51.1 23.36,18.09 23.45,18.19 23.46,18.17 U18.1 23.46,16.59 C50.1 | R35.1 21.92,22.3 v22.43,22.81 v22.44,22.82 R36.1 | 34.45,9.85 U20.2 33.83,10.57 33.58,10.82 32.46,10.82 32.26,11.02 32.26,13.31 32.87,13.92 | 34.45,9.85 U20.3 | 34.45,9.85 34.45,10.01 34.55,10.11 35.55,10.11 C56.1 v35.61,9.35 | C58.1 34.86,18.09 34.95,18.19 34.97,18.17 U21.1 34.97,16.59 C57.1 | R40.1 33.43,22.3 v33.94,22.81 v33.95,22.82 R41.1 | 45.98,9.85 U23.2 45.36,10.57 45.11,10.82 43.99,10.82 43.79,11.02 43.79,13.31 44.4,13.92 | 45.98,9.85 U23.3 | 45.98,9.85 45.98,10.01 46.08,10.11 47.08,10.11 C63.1 v47.15,9.35 | C65.1 46.39,18.09 46.48,18.19 46.5,18.17 U24.1 46.5,16.59 C64.1 | R45.1 44.96,22.3 v45.47,22.81 v45.48,22.82 R46.1
  Top 0.152: C81.1 C82.1 37.59,32.6 37.91,32.92 U25.20 | U13.6 56.94,6.85 56.84,6.76 56.84,5.33 57.34,4.84 C38.1 57.35,4.26 v57.35,2.95 | R7.1 61.69,42.5 61.72,42.47 | v56.95,18.8 v56.95,18.79 C39.1 56.79,17.71 56.79,15.85 | U14.5 56.81,15.87 56.79,15.85 | 56.79,15.85 56.79,14.83 56.54,14.58 56.39,14.58 56.23,14.43 C36.1 56.23,13.16 55.78,12.71 U12.1 | C27.1 C10.1 U5.21 | 28.68,9.35 C47.1 29.14,10.07 29.49,10.42 | R30.1 R31.1 4.67,25.56 R26.1 v4.56,22.87 v4.57,22.86 3.46,21.75 3.45,21.75 | 1.78,41.7 1.78,43.22 R51.1 R61.1 | J9.2 4.22,16.86 3.81,17.27 3.81,21.39 3.45,21.75 | R27.1 3.45,21.75
  Top 0.229: v17.48,9.04 17.17,9.35 C12.1 17.63,10.07 17.99,10.42 17.99,11.85 17.16,12.68 U1.6 17.16,13.75 17.22,13.82 18.28,13.82 C13.1 | R25.1 9.86,13.92 9.86,14.48 10.11,14.73 11.28,14.73 11.57,15.02 C19.1 | C20.1 9.85,18.09 9.55,18.39 9.55,21.74 9.86,22.05 10.41,22.05 R18.1 | C6.1 R9.1 38.89,38.33 37.91,37.35 U25.20 | C9.1 C33.1 50.13,38.65 v49.73,38.25 | R23.1 5.71,28.11 v5.25,28.57 v5.25,30.5 v5.25,32.53 5.28,32.55 C24.1 C25.1 8.38,32.55 8.7,32.87 U8.20 v8.7,37.13 v8.69,37.13 | U4.4 22.02,29.08 v22.02,30.6 22.02,31.21 22.42,31.61 C5.1 | v10.64,30.5 10.64,30.49 U8.4 10.64,28.02 7.77,25.15 v7.77,22.81 | 28.68,9.35 v28.99,9.04 | C50.1 23.08,15.02 22.79,14.73 21.62,14.73 21.37,14.48 R37.1 | 29.79,13.82 C48.1 29.69,13.72 28.65,13.72 28.65,13.39 | 29.49,10.42 29.49,11.85 28.65,12.69 28.65,13.39 | C51.1 21.36,18.09 21.06,18.39 21.06,21.74 21.37,22.05 R35.1 | 28.65,13.39 U16.6 | v40.49,9.04 40.19,9.35 C54.1 40.64,10.07 41,10.42 41,11.85 40.17,12.68 U19.6 40.17,13.75 40.24,13.82 41.29,13.82 C55.1 | R42.1 32.87,13.92 32.87,14.48 33.12,14.73 34.29,14.73 34.58,15.02 C57.1 | C58.1 32.86,18.09 32.56,18.39 32.56,21.74 32.87,22.05 R40.1 | v52.02,9.04 51.72,9.35 C61.1 52.17,10.07 52.53,10.42 52.53,11.85 51.7,12.68 U22.6 51.7,13.75 51.77,13.82 52.82,13.82 C62.1 | R47.1 44.4,13.92 44.4,14.48 44.66,14.73 45.82,14.73 46.12,15.02 C64.1 | C65.1 44.39,18.09 44.1,18.39 44.1,21.74 44.4,22.05 R45.1 | R56.1 34.92,28.16 v34.46,28.62 v34.46,30.55 v34.46,32.58 34.49,32.6 C81.1 | U15.4 51.23,29.13 v51.23,30.65 51.23,31.26 51.63,31.66 C74.1 | U25.4 39.85,30.54 v39.85,30.55 | C4.1 58.95,44.13 59.54,43.55 U3.5 60.48,42.8 R7.1
  Top 0.229: v12.55,37.54 12.59,37.58 R48.1 R32.1 12.59,40.28 13.41,41.1 13.41,43.03 13.01,43.43 R50.1 R49.1 | v3.86,37.13 3.86,38.51 | 3.86,38.51 R12.1 | C27.1 1.78,41.7 1.37,41.3 1.37,38.81 1.67,38.51 3.86,38.51
  Top 0.305: U11.4 44.64,40.81 44.91,40.54 44.91,38.81 v44.43,38.33 C6.1
  Top 0.457: 61.69,42.5 61.92,42.27 61.92,40.64 60.86,39.57 60.86,30.68 v61.92,29.62 61.92,26.87 60.2,25.15 v60.2,22.81 v60.2,18.8 60.2,10.11 v60.66,9.65
  Bottom 0.152: v56.95,18.8 v60.2,18.8 | v7.77,22.81 4.62,22.81 v4.57,22.86
  Bottom 0.229: v17.48,9.04 12.91,9.04 v12.6,9.35 | v22.02,30.6 21.56,31.05 16.63,31.05 16.27,30.7 13.53,30.7 13.33,30.9 12.01,30.9 11.6,30.5 v10.64,30.5 v5.25,30.5 | v28.99,9.04 24.41,9.04 v24.11,9.35 | v40.49,9.04 35.92,9.04 v35.61,9.35 | v52.02,9.04 47.45,9.04 v47.15,9.35 | v51.23,30.65 50.77,31.11 45.84,31.11 45.48,30.75 42.74,30.75 42.54,30.95 41.22,30.95 40.81,30.55 v39.85,30.55 v34.46,30.55 | v44.43,38.33 49.65,38.33 v49.73,38.25 | v12.55,37.54 12.45,37.64 9.2,37.64 v8.69,37.13 v3.86,37.13
  Bottom 0.305: v7.77,22.81 v10.92,22.81 v22.43,22.81 v33.94,22.81 v45.47,22.81 v60.2,22.81 | v51.23,30.65 52.26,29.62 v61.92,29.62 | v22.02,30.6 23,29.62 33.53,29.62 v34.46,30.55
  Bottom 0.457: v60.66,9.65 60.66,4.01 59.59,2.95 v57.35,2.95
VCC/2  (via drill 0.25)
  Top 0.127: U7.3 12.96,19.2 v12.6,19.56 | R11.2 14.26,15.04 15.09,15.04 15.26,15.2 U1.3 | R13.1 v16.05,9.65 | U18.3 24.46,19.2 v24.11,19.56 | R33.2 25.77,15.04 26.6,15.04 26.77,15.2 U16.3 | R34.1 v27.56,9.65 | U21.3 35.97,19.2 v35.61,19.56 | R38.2 37.28,15.04 38.1,15.04 38.27,15.2 U19.3 | R39.1 v39.07,9.65 | U24.3 47.5,19.2 v47.15,19.56 | R43.2 48.81,15.04 49.63,15.04 49.8,15.2 U22.3 | R44.1 v50.6,9.65
  Top 0.152: C33.2 C34.1 | C16.2 19.89,37.39 v19.88,37.41 | v19.88,26.53 19.88,27.39 C17.2 | C29.2 v24.19,37.39 v24.2,37.41 | C30.2 24.2,27.41 v24.2,26.53 | U8.10 14.55,28.06 14.39,27.91 13.23,27.91 | U8.6 11.95,28.07 12.11,27.91 13.23,27.91 | 13.23,27.91 13.24,27.92 U8.8 13.24,33.23 13.89,33.88 U8.12 | C76.2 49.1,37.45 v49.09,37.46 | v49.09,26.58 49.09,27.44 C77.2 | C85.2 53.4,37.45 v53.41,37.46 | C86.2 53.41,27.46 v53.41,26.58 | U25.10 43.76,28.11 43.6,27.96 42.44,27.96 | U25.6 41.16,28.12 41.32,27.96 42.44,27.96 | 42.44,27.96 42.45,27.97 U25.8 42.45,33.28 43.1,33.93 U25.12 | U11.10 47.37,40.16 v47.35,40.13
  Top 0.229: U7.3 12.96,15.65 | R11.2 13.12,15.48 12.96,15.65 | 12.96,15.65 12.96,12.6 13.66,11.9 v13.66,9.65 | U11.1 U11.2 v44.25,42.11 | C33.2 C9.2 | C8.1 C34.1 49.88,41.7 49.64,41.46 U11.12 v47.35,41.46 v47.35,41.45 v47.35,40.13 47.37,40.16 | C26.1 C5.2 28.6,31.06 28.6,27.23 v27.84,26.47 v27.84,19.56 | U18.3 24.46,15.65 | R33.2 24.63,15.48 24.46,15.65 | 24.46,15.65 24.46,12.6 25.16,11.9 v25.16,9.65 | U21.3 35.97,15.65 | R38.2 36.13,15.48 35.97,15.65 | 35.97,15.65 35.97,12.6 36.67,11.9 v36.67,9.65 | U24.3 47.5,15.65 | R43.2 47.67,15.48 47.5,15.65 | 47.5,15.65 47.5,12.6 48.2,11.9 v48.2,9.65 | U11.5 43.01,40.18 v44.25,40.18 | v13.26,26.52 13.24,26.53 13.24,27.92 | C83.1 C74.2 57.91,31.01 v57.91,26.87 | v42.47,26.57 42.45,26.58 42.45,27.97
  Top 0.305: v42.47,26.57 v42.47,19.56 | v47.35,40.13 47.35,38.2 48.09,37.46 v49.09,37.46 | v31.29,19.56 31.29,26.31 31.9,26.92 31.9,37.39 | v31.8,39.52 31.8,38.76 31.9,38.66 31.9,37.39 | 31.9,37.39 v31.29,37.39
  Bottom 0.152: v19.88,37.41 v24.2,37.41 | v49.09,37.46 v53.41,37.46
  Bottom 0.229: v13.66,9.65 v16.05,9.65 | v25.16,9.65 v27.56,9.65 | v36.67,9.65 v39.07,9.65 | v48.2,9.65 v50.6,9.65 | 47.3,40.18 v47.35,40.13 | v12.6,19.56 v24.11,19.56 v27.84,19.56 v31.29,19.56 v35.61,19.56 v42.47,19.56 v47.15,19.56 | 27.77,26.53 v27.84,26.47 | 13.28,26.53 v13.26,26.52 | v53.41,26.58 57.62,26.58 v57.91,26.87
  Bottom 0.305: v47.35,41.45 44.91,41.45 v44.25,42.11 | 47.3,40.18 v44.25,40.18 42.93,40.18 42.27,39.52 v31.8,39.52 | 27.77,26.53 v24.2,26.53 v19.88,26.53 13.28,26.53 | v53.41,26.58 v49.09,26.58 42.48,26.58 v42.47,26.57 | v24.2,37.41 24.57,37.03 28.3,37.03 28.65,37.39 v31.29,37.39
VCC/2_UNBUFFERED
  Top 0.229: C6.2 R9.2 R10.1 C7.1 41.36,41.46 U11.3
VOC_DISCONNECT_0  (via drill 0.25)
  Top 0.127: U6.6 | R25.2 9.86,12.7 10.17,12.39
  Top 0.152: U6.6 10.17,12.39 | R25.2 9.96,12.81 10.72,13.56 v10.72,13.92 | v30.33,12.14 30.94,12.75 30.94,17.02 29.87,18.09 29.87,37.8 30.53,38.46 30.53,42.57 31.23,43.27 JP2.22
  Bottom 0.152: v10.72,13.92 11.63,13.01 29.46,13.01 v30.33,12.14
VOC_DISCONNECT_1  (via drill 0.25)
  Top 0.127: U17.6 21.68,12.39 21.37,12.7 R37.2
  Top 0.152: R37.2 22.32,13.77 v22.35,13.77 | v30.17,13.05 30.22,13.05 30.63,13.46 30.63,16.82 29.52,17.93 29.52,37.74 28.09,39.17 v28.09,39.32 | v22.5,39.32 22.3,39.52 22.3,46.18 22.3,46.43 22.3,48.04 JP2.29
  Bottom 0.152: v22.35,13.77 22.76,13.36 29.86,13.36 v30.17,13.05 | v28.09,39.32 v22.5,39.32
VOC_DISCONNECT_2  (via drill 0.25)
  Top 0.127: U20.6 33.18,12.39 32.87,12.7 R42.2
  Top 0.152: R42.2 33.52,13.46 v33.98,13.46 | v30.89,11.28 30.89,12.3 31.27,12.69 31.27,17.18 30.23,18.23 30.23,37.69 30.84,38.3 30.84,42.37 31.98,43.51 v32.11,43.51 | v36.32,43.51 36.32,46.72 JP2.18
  Bottom 0.152: v33.98,13.46 31.8,11.28 v30.89,11.28 | v32.11,43.51 v36.32,43.51
VOC_DISCONNECT_3  (via drill 0.25)
  Top 0.127: U23.6 44.71,12.39 44.4,12.7 R47.2
  Top 0.152: R47.2 44.9,13.31 v45.52,13.31 | v30.63,10.06 31.6,11.02 31.6,17.48 30.58,18.49 30.58,37.54 31.19,38.15 31.19,41.96 32.21,42.98 v33.22,42.98 | v38.05,42.98 38.85,43.78 JP2.16
  Bottom 0.152: v45.52,13.31 34.8,13.31 31.55,10.06 v30.63,10.06 | v33.22,42.98 v38.05,42.98
VSENSE_LPF_0  (via drill 0.25)
  Top 0.152: U4.2 20.14,29.06 | 20.14,29.06 U4.1 | 19.95,28.88 20.14,29.06 | U4.1 20.08,28.82 20.19,28.72 18.88,28.72 C18.1 | U4.1 v20.08,30.29 v20.09,30.29 | U8.7 12.6,30.27 v12.62,30.29
  Bottom 0.152: v20.09,30.29 v12.62,30.29
VSENSE_LPF_1  (via drill 0.25)
  Top 0.152: 23.95,29.06 U4.6 v23.34,30.29 | 23.95,29.06 U4.7 | C31.1 24.13,28.88 23.95,29.06 | U8.11 v14.54,32.78 v14.55,32.78
  Bottom 0.152: v14.55,32.78 14.7,32.63 22.88,32.63 23.34,32.17 v23.34,30.29
VSENSE_LPF_2  (via drill 0.25)
  Top 0.152: U15.2 49.35,29.11 | 49.35,29.11 U15.1 | 49.16,28.93 49.35,29.11 | U15.1 49.29,28.87 49.4,28.77 48.09,28.77 C78.1 | U15.1 v49.29,30.34 v49.3,30.34 | U25.7 41.8,30.32 v41.83,30.34
  Bottom 0.152: v49.3,30.34 v41.83,30.34
VSENSE_LPF_3  (via drill 0.25)
  Top 0.152: 53.16,29.11 U15.6 v52.55,30.34 | 53.16,29.11 U15.7 | C87.1 53.34,28.93 53.16,29.11 | U25.11 v43.76,32.84 v43.76,32.83
  Bottom 0.152: v43.76,32.83 52.04,32.83 52.55,32.33 v52.55,30.34
VSENSE_V+_0
  Top 0.152: R17.2 16.58,30.65 16.83,30.9 20.95,30.9 21.38,30.47 U4.3 21.38,27.59 C17.1
VSENSE_V+_1
  Top 0.152: R24.2 27.5,30.6 27.2,30.9 23.13,30.9 22.68,30.45 U4.5 22.68,27.7 C30.1
VSENSE_V+_2
  Top 0.152: R55.2 45.79,30.7 46.04,30.95 50.16,30.95 50.59,30.52 U15.3 50.59,27.64 C77.1
VSENSE_V+_3
  Top 0.152: R60.2 56.71,30.65 56.41,30.95 52.34,30.95 51.89,30.5 U15.5 51.89,27.75 C86.1
VSYS  (via drill 0.25)
  Top 0.152: Q2.2 67.45,21.32 68.57,22.45 R1.2 | Q1.2 66.38,22.93 Q2.2 | Q2.2 Q2.1 | U13.1 55.57,7.17 55.28,7.46 C37.1 v54.1,12.39 | C35.1 57.53,10.33 57.28,10.59 57.28,12.14 57.52,12.38 U12.6 58.03,12.82 58.47,13.26 v59.03,13.26 59.03,14.53 59.06,14.56
  Top 0.229: U3.3 57.77,40.91 58.22,41.35 58.22,42.57 57.98,42.8 U3.1 55.74,42.8 C3.1 | Q2.1 68.11,19.42 69.13,18.4 v69.13,17.32 J3.2
  Top 0.305: U3.3 56.96,38.8 60.25,35.51 60.25,30.12 61.11,29.26 61.11,27.08 59.49,25.45 59.49,14.99 59.06,14.56
  Bottom 0.152: v54.1,12.39 54.97,13.26 v59.03,13.26 62.43,13.26 62.84,13.66
  Bottom 0.229: v69.13,17.32 66.5,17.32 62.84,13.66
VUSB
  Top 0.229: J2.B4A9 67.86,43.34 67.36,43.84 64.62,43.84 63.7,42.93 63.7,38.56 | 63.7,38.56 JP1.2 | 63.7,38.56 63.72,38.55 J2.A4B9

## Text on the board
tPlace: Ka Moamoa | gnd / vcc / sda / scl | i2c expansion / connector | MFC I/V Board / with load / potentiometer | MFC+ | MFC-
bPlace: Soil-based / gaming console / for computers
tNames: TX